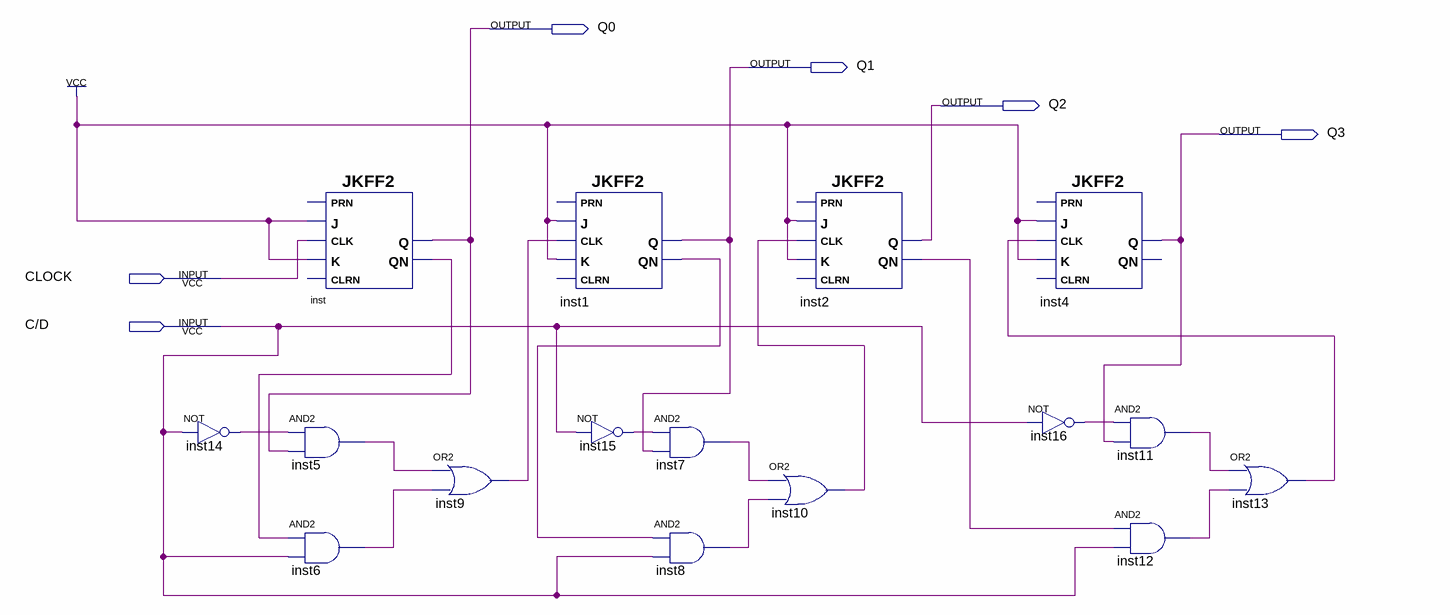
[diagram p0: schematic sheet]
// Quartus schematic ex4.bdf as structural Verilog: 16 symbols, 6 pins
module ex4 (
  input  CLOCK,
  input  \C/D ,
  output Q0,
  output Q1,
  output Q2,
  output Q3
);

  wire inst1_qn, inst2_qn, inst5_out, inst6_out, inst7_out, inst8_out, inst9_out, inst10_out, inst11_out,
       inst12_out, inst13_out, inst14_out, inst15_out, inst16_out, inst_qn;

  not inst14 (inst14_out, \C/D );
  JKFF2 inst (.K(1'b1), .CLK(CLOCK), .J(1'b1), .QN(inst_qn), .Q(Q0));  // open: CLRN, PRN
  and inst5 (inst5_out, inst14_out, Q0);
  and inst6 (inst6_out, inst_qn, \C/D );
  or inst9 (inst9_out, inst5_out, inst6_out);
  JKFF2 inst1 (.K(1'b1), .CLK(inst9_out), .J(1'b1), .QN(inst1_qn), .Q(Q1));  // open: CLRN, PRN
  not inst15 (inst15_out, \C/D );
  and inst7 (inst7_out, inst15_out, Q1);
  and inst8 (inst8_out, inst1_qn, \C/D );
  or inst10 (inst10_out, inst7_out, inst8_out);
  JKFF2 inst2 (.K(1'b1), .CLK(inst10_out), .J(1'b1), .QN(inst2_qn), .Q(Q2));  // open: CLRN, PRN
  JKFF2 inst4 (.K(1'b1), .CLK(inst13_out), .J(1'b1), .Q(Q3));  // open: CLRN, PRN, QN
  not inst16 (inst16_out, \C/D );
  and inst11 (inst11_out, inst16_out, Q3);
  and inst12 (inst12_out, inst2_qn, \C/D );
  or inst13 (inst13_out, inst11_out, inst12_out);
endmodule
